# Altium schematic sheet v1.0.SchDoc
size 182 x 63 mm
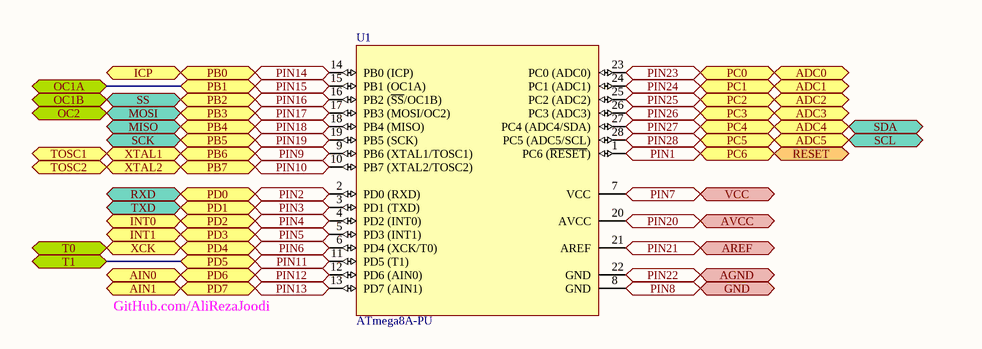
[diagram p0: v1.0.SchDoc]

## Parts
U1  ATmega8A-PU  [28P3]

## Ports
ADC0 (bidir), ADC1 (bidir), ADC2 (bidir), ADC3 (bidir), ADC4 (bidir), ADC5 (bidir), AGND, AIN0 (bidir), AIN1 (bidir), AREF, AVCC, GND, ICP (bidir), INT0 (bidir), INT1 (bidir), MISO (bidir), MOSI (bidir), OC1A (bidir), OC1B (bidir), OC2 (bidir), PB0 (bidir), PB1 (bidir), PB2 (bidir), PB3 (bidir), PB4 (bidir), PB5 (bidir), PB6 (bidir), PB7 (bidir), PC0 (bidir), PC1 (bidir), PC2 (bidir), PC3 (bidir), PC4 (bidir), PC5 (bidir), PC6 (bidir), PD0 (bidir), PD1 (bidir), PD2 (bidir), PD3 (bidir), PD4 (bidir), PD5 (bidir), PD6 (bidir), PD7 (bidir), PIN1, PIN2, PIN3, PIN4, PIN5, PIN6, PIN7, PIN8, PIN9, PIN10, PIN11, PIN12, PIN13, PIN14, PIN15, PIN16, PIN17, PIN18, PIN19, PIN20, PIN21, PIN22, PIN23, PIN24, PIN25, PIN26, PIN27, PIN28, RESET, RXD (bidir), SCK (bidir), SCL (bidir), SDA (bidir), SS (bidir), T0 (bidir), T1 (bidir), TOSC1 (bidir), TOSC2 (bidir), TXD (bidir), VCC, XCK (bidir), XTAL1 (bidir), XTAL2 (bidir)

## Nets
ADC0: U1.23(PC0_(ADC0)) ; port ADC0, port PC0, port PIN23
ADC1: U1.24(PC1_(ADC1)) ; port ADC1, port PC1, port PIN24
ADC2: U1.25(PC2_(ADC2)) ; port ADC2, port PC2, port PIN25
ADC3: U1.26(PC3_(ADC3)) ; port ADC3, port PC3, port PIN26
ADC4: U1.27(PC4_(ADC4/SDA)) ; port SDA, port ADC4, port PC4, port PIN27
ADC5: U1.28(PC5_(ADC5/SCL)) ; port SCL, port ADC5, port PC5, port PIN28
AGND: U1.22(GND) ; port AGND, port PIN22
AIN0: U1.12(PD6_(AIN0)) ; port PD6, port AIN0, port PIN12
AIN1: U1.13(PD7_(AIN1)) ; port PD7, port AIN1, port PIN13
AREF: U1.21(AREF) ; port AREF, port PIN21
AVCC: U1.20(AVCC) ; port AVCC, port PIN20
GND: U1.8(GND) ; port GND, port PIN8
ICP: U1.14(PB0_(ICP)) ; port PB0, port ICP, port PIN14
INT0: U1.4(PD2_(INT0)) ; port PD2, port INT0, port PIN4
INT1: U1.5(PD3_(INT1)) ; port PD3, port INT1, port PIN5
MISO: U1.18(PB4_(MISO)) ; port MISO, port PB4, port PIN18
MOSI: U1.17(PB3_(MOSI/OC2)) ; port MOSI, port PB3, port OC2, port PIN17
OC1A: U1.15(PB1_(OC1A)) ; port PB1, port OC1A, port PIN15
OC1B: U1.16(PB2_(~{SS}/OC1B)) ; port PB2, port OC1B, port SS, port PIN16
PB5: U1.19(PB5_(SCK)) ; port SCK, port PB5, port PIN19
PB6: U1.9(PB6_(XTAL1/TOSC1)) ; port XTAL1, port TOSC1, port PB6, port PIN9
PB7: U1.10(PB7_(XTAL2/TOSC2)) ; port XTAL2, port TOSC2, port PB7, port PIN10
PC6: U1.1(PC6_(~{RESET})) ; port RESET, port PC6, port PIN1
PD0: U1.2(PD0_(RXD)) ; port RXD, port PD0, port PIN2
PD1: U1.3(PD1_(TXD)) ; port TXD, port PD1, port PIN3
PD4: U1.6(PD4_(XCK/T0)) ; port PD4, port XCK, port T0, port PIN6
PD5: U1.11(PD5_(T1)) ; port PD5, port T1, port PIN11
PIN7: U1.7(VCC) ; port VCC, port PIN7

## Notes on the sheet
- GitHub.com/AliRezaJoodi

## Library data of the parts
U1 = ATmega8A-PU: 8-bit AVR Microcontroller, 8KB Flash, 512 Bytes EEPROM, 1KB SRAM, 28-pin PDIP, Industrial Grade (-40°C to 85°C); Published: 1-Apr-2010; DatasheetVersion: revC, Jul-2009; PackageVersion: revB, Sep-2001; PackageReference: 28P3; Publisher: Altium Limited; PackageDescription: 28-lead (0.300"/7.62mm Wide) Plastic Dual Inline Package (PDIP); Supplier 1: Digi-Key; Supplier Part Number 1: ATMEGA8A-PU-ND; Supplier 2: Farnell; Supplier Part Number 2: 1748534; Supplier 3: Mouser; Supplier Part Number 3: 556-ATMEGA8A-PU; ComponentLink1Description: Manufacturer Link; ComponentLink1URL: http://www.atmel.com/products/avr/default.asp?; ComponentLink2Description: ATmega8A Datasheet; ComponentLink2URL: http://www.atmel.com/dyn/resources/prod_documents/doc8159.pdf; ComponentLink3Description: ATmega8A Summary; ComponentLink3URL: http://www.atmel.com/dyn/resources/prod_documents/8159S.pdf; ComponentLink4Description: Atmel.com Home; ComponentLink4URL: http://www.atmel.com